# EAGLE schematic centre Contact (EAGLE 9.6.2)
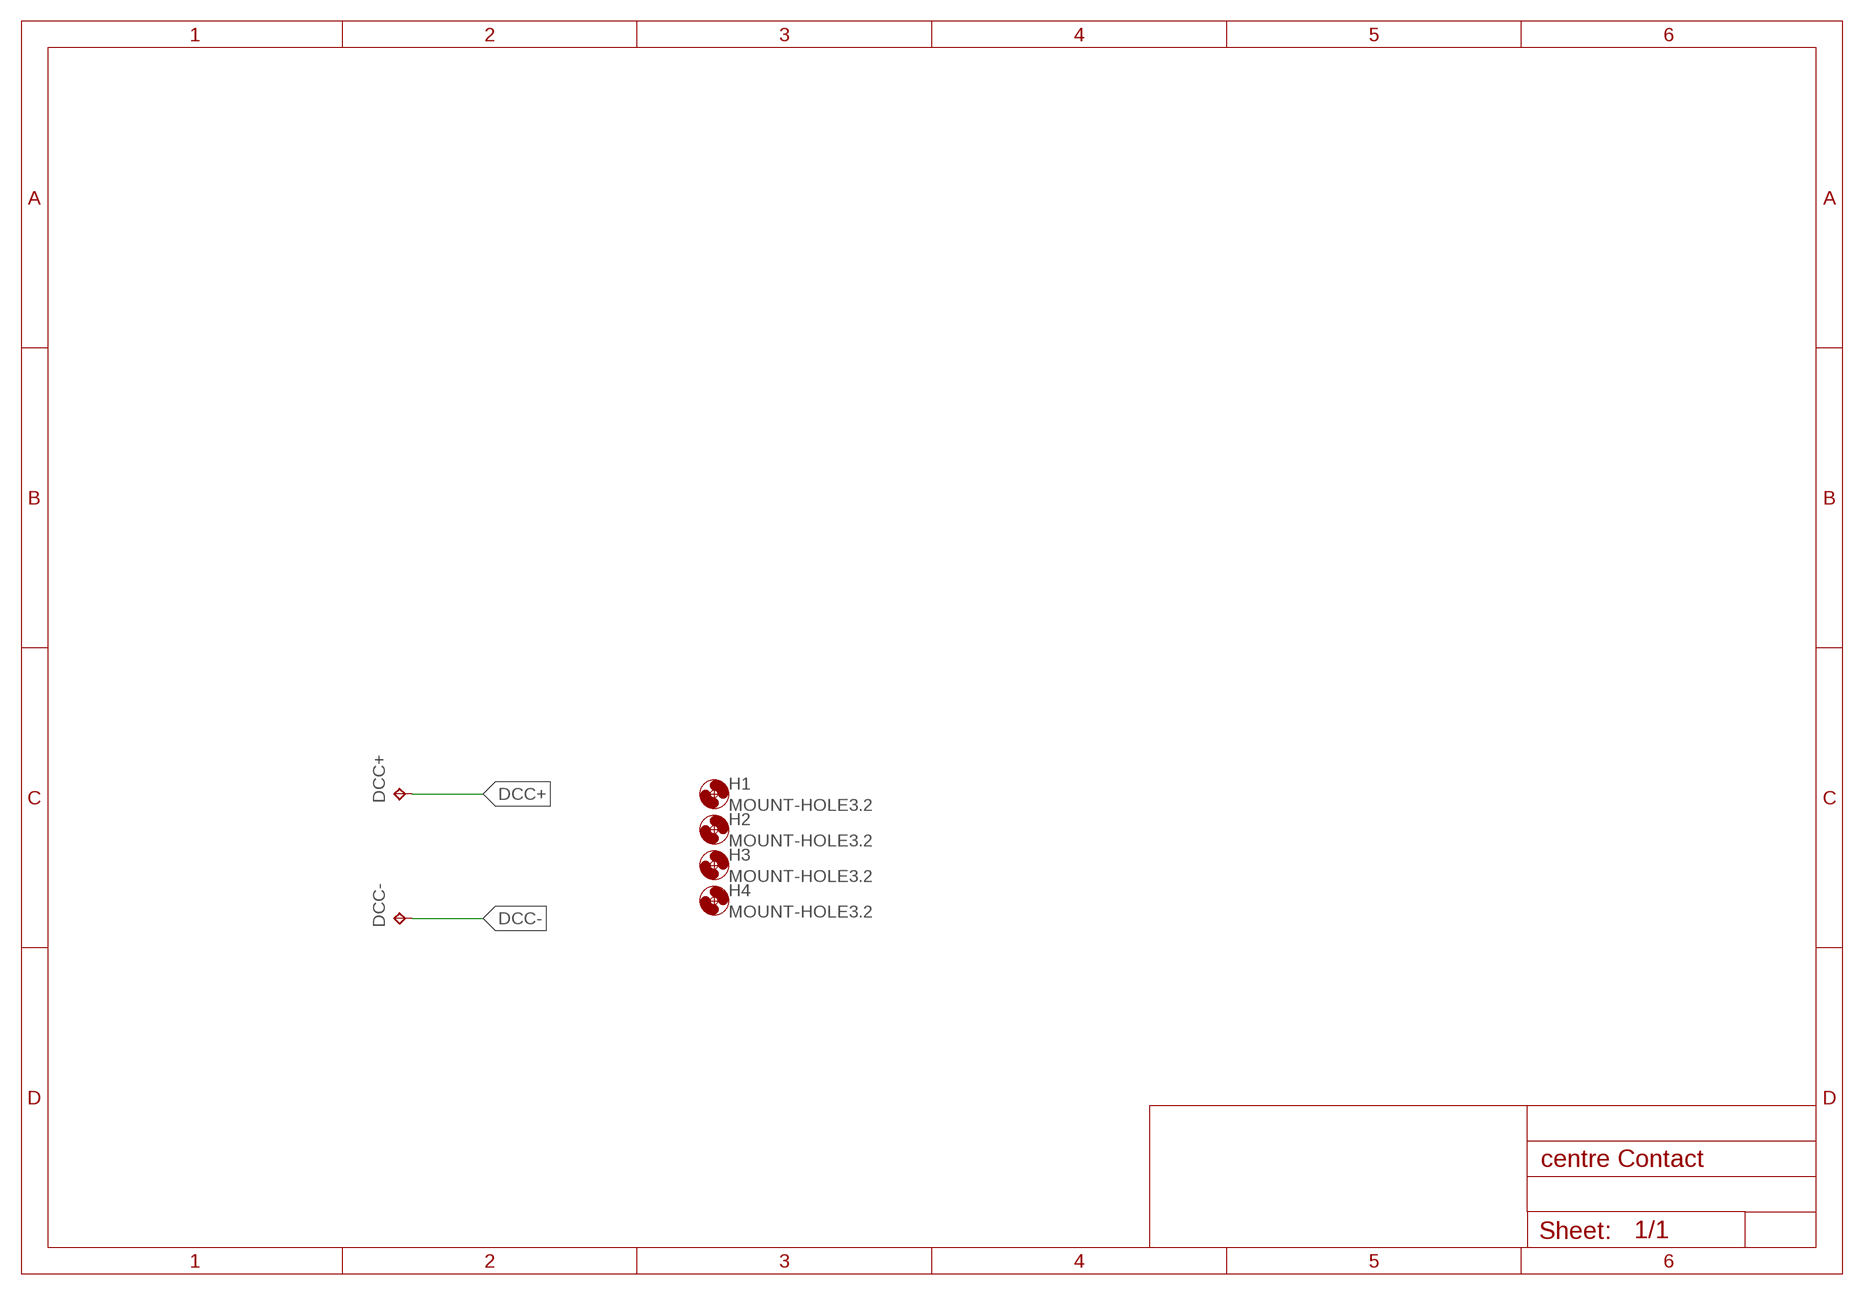
[diagram p0: schematic, sheet 1]

## Parts
DCC+  TPB2,54  [B2,54]
DCC-  TPB2,54  [B2,54]
H1  MOUNT-HOLE3.2  [3,2]
H2  MOUNT-HOLE3.2  [3,2]
H3  MOUNT-HOLE3.2  [3,2]
H4  MOUNT-HOLE3.2  [3,2]

## Nets
DCC+: DCC+.TP
DCC-: DCC-.TP

## Library data of the parts
DCC+ DCC- = testpad:TP: Test pad
H1-H4 = holes:MOUNT-HOLE: MOUNTING HOLE with drill center marker